# EasyEDA Pro project 毕设.eprj, board PCB1
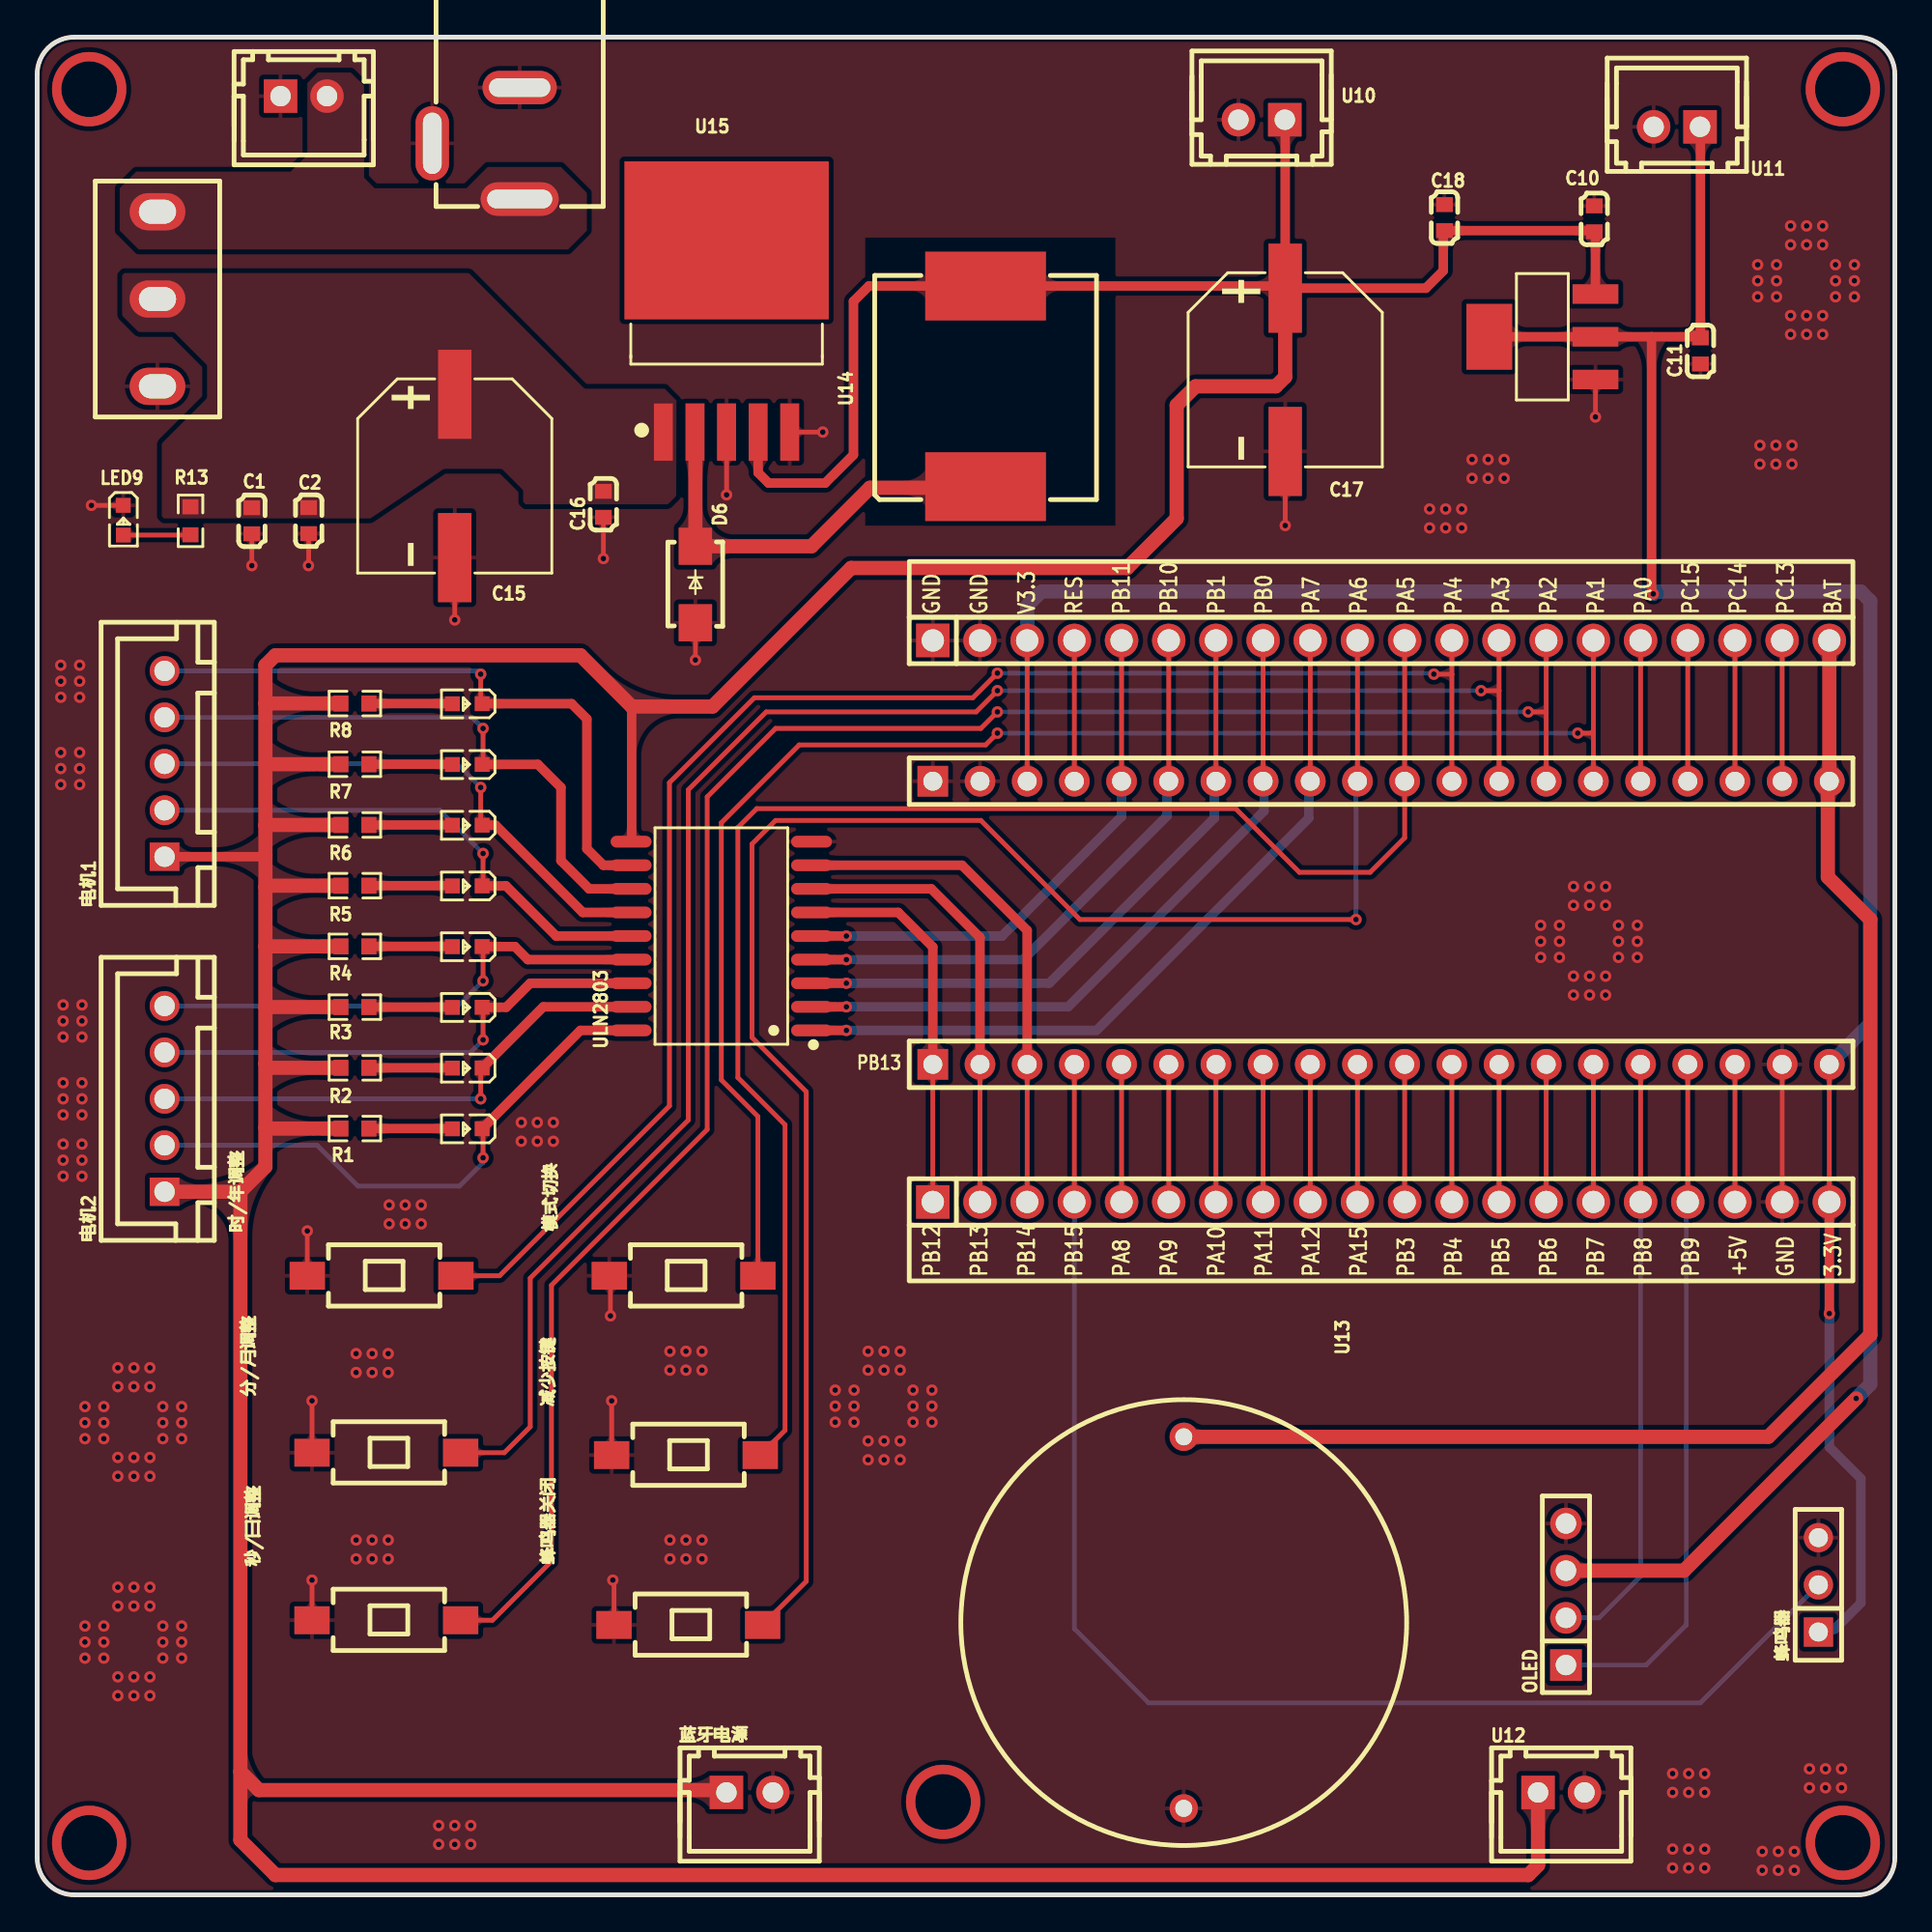
[diagram p3: board, top side]
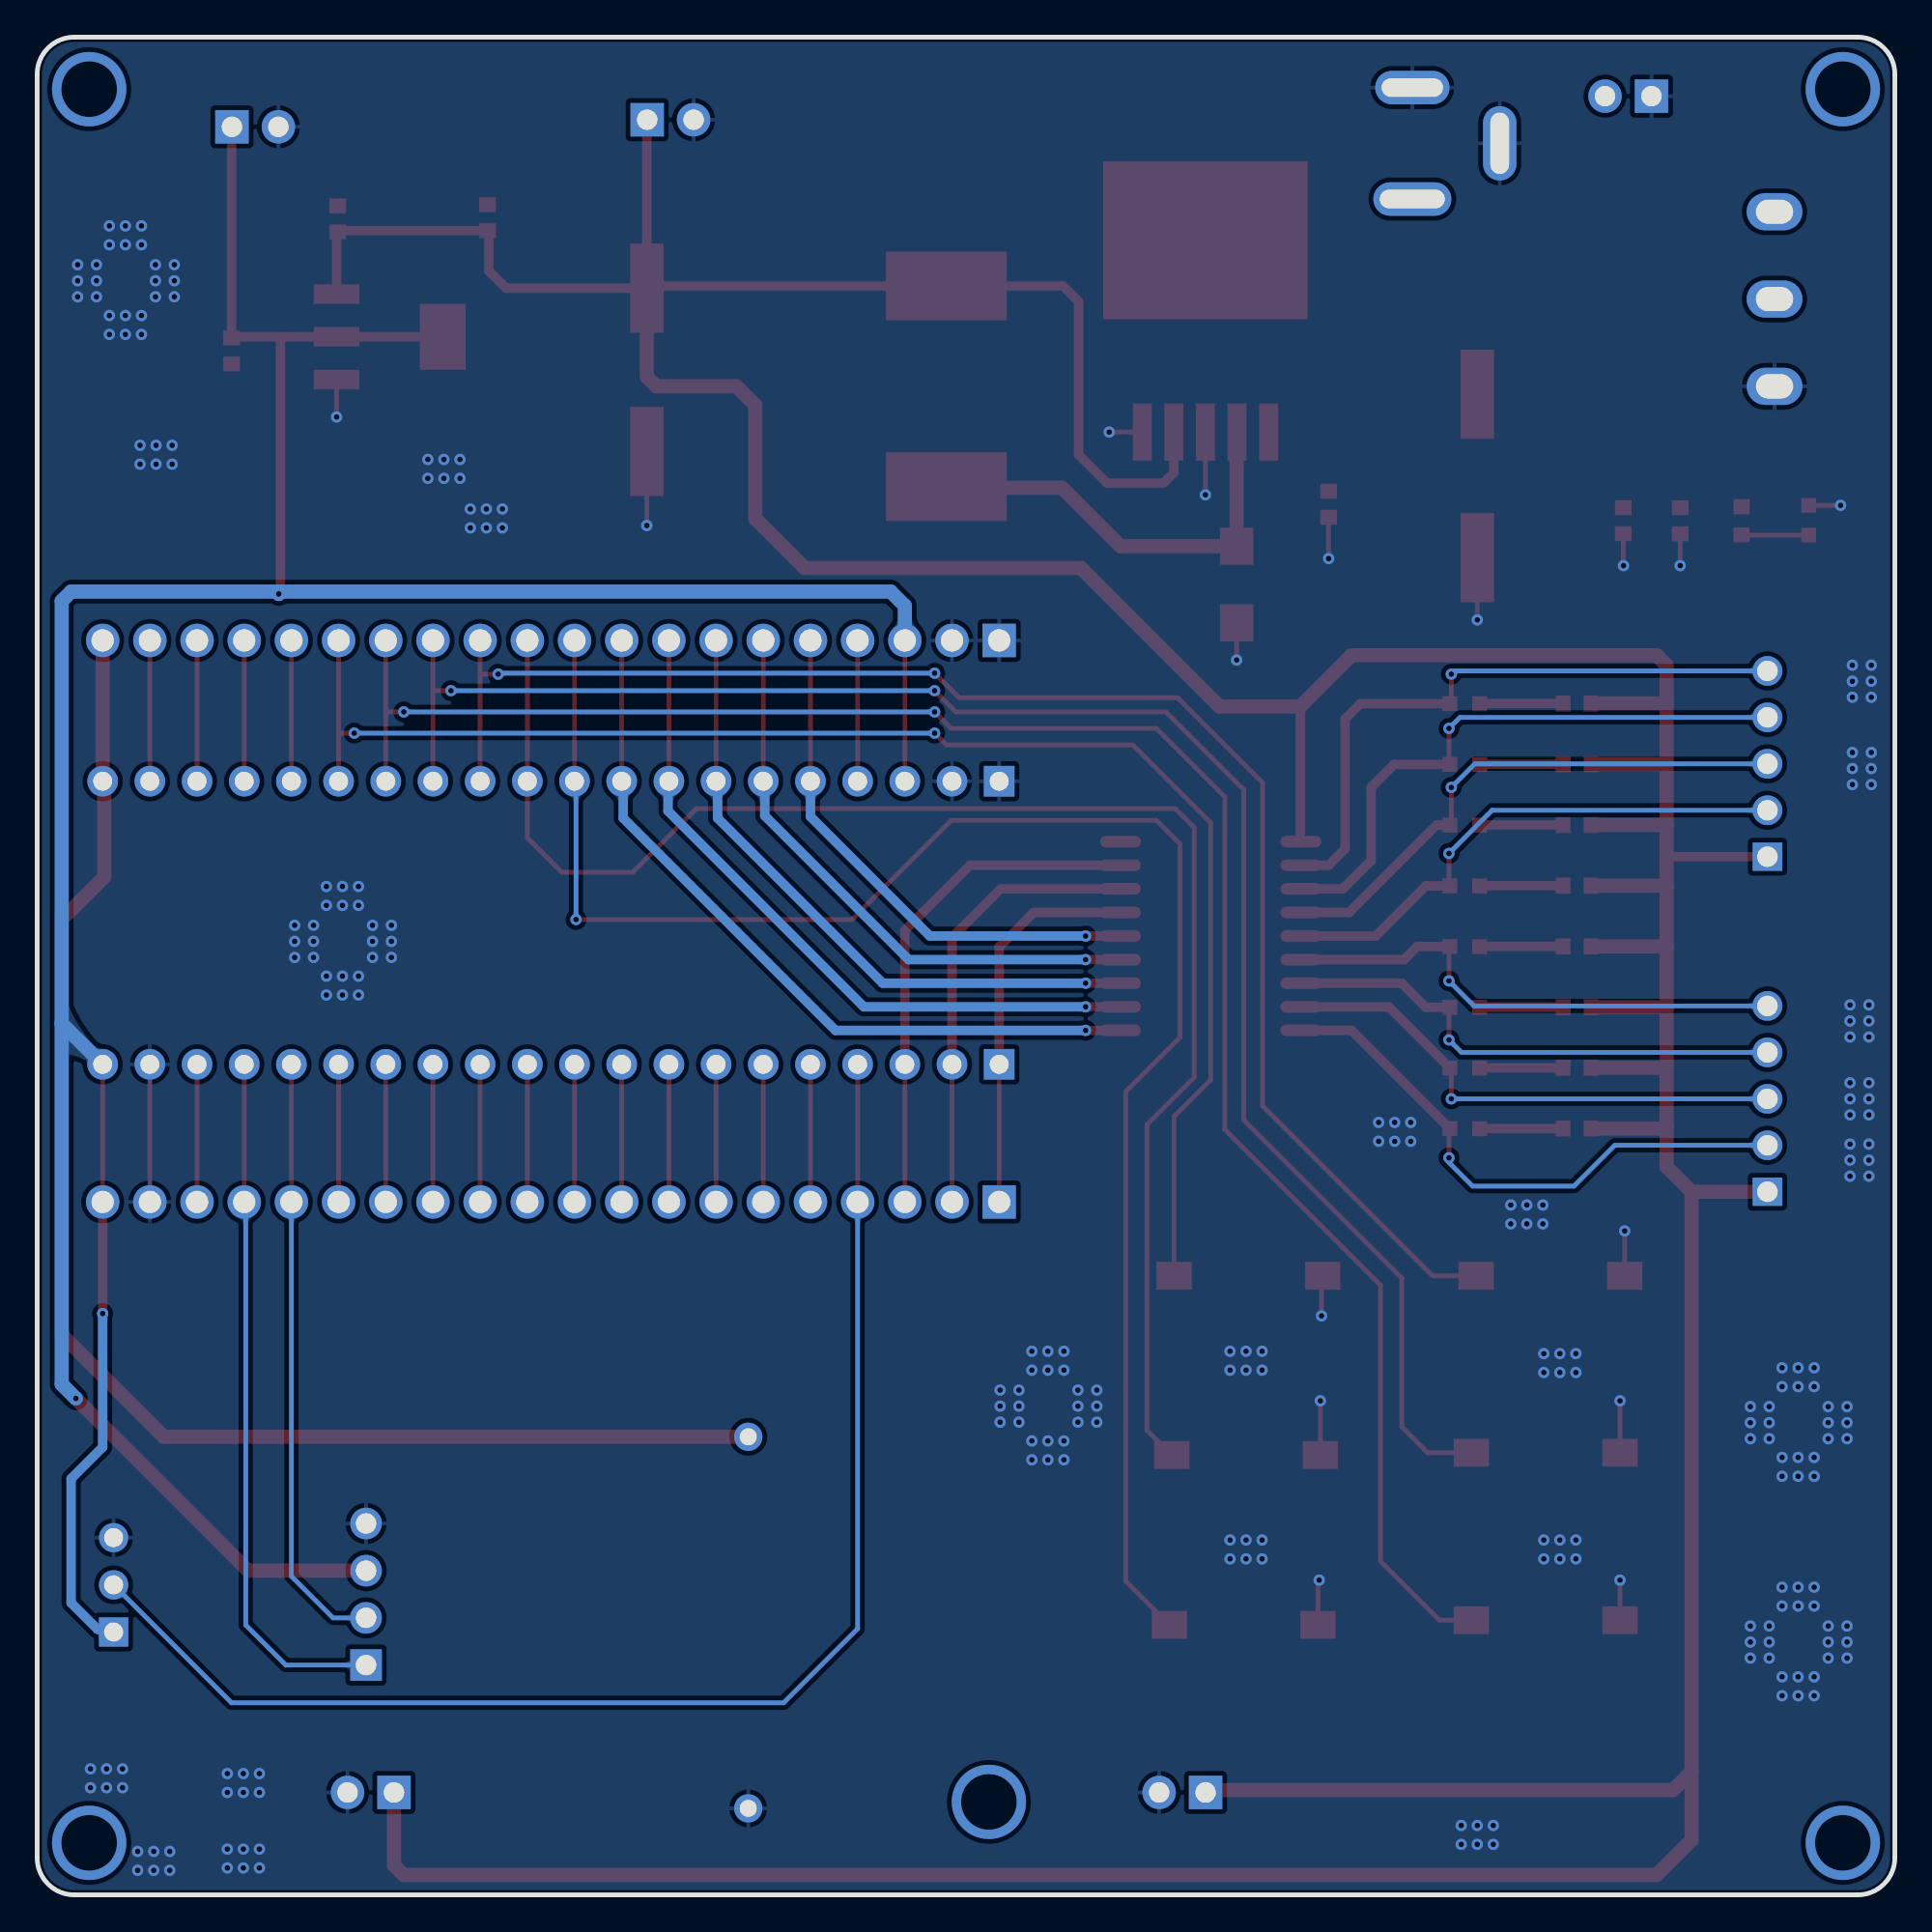
[diagram p4: board, bottom side, seen from below]

Outline 100 x 100 mm; copper layers: Top Layer, Bottom Layer. Coordinates in mm from the lower left corner of the outline.
Outline path: 0,98 0,2 arc(0.59,0.59) 2,0 98,0 arc(99.41,0.59) 100,2 100,98 arc(99.41,99.41) 98,100 2,100 arc(0.59,99.41) 0,98
Stack: Top Layer 0.035mm / Dielectric1 1.51mm FR4 er 4.5 / Bottom Layer 0.035mm

## Design rules (mm)
template: JLCPCB Capability(Two Layers Board)
spacing copperThickness1oz (default): track to track 0.102, other pairs 0.152 to 0.3
spacing copperThickness2oz: track to track 0.203, other pairs 0.152 to 0.3
track width copperThickness1oz (default): min 0.127, default 0.254, max 2.54
track width copperThickness2oz: min 0.203, default 0.254, max 2.54
differential pair differentialPair (default): width min 0.127, default 0.254, max 2.54; gap min 0.152, default 0.152
via viaSize (default): diameter min 0.5, default 0.61, max 10; hole min 0.3, default 0.305, max 6.3

## Placement (name value [footprint] x y rotation side)
C1  100nF  [C0603]  11.56 73.97 270 top
C2  100nF  [C0603]  14.62 73.97 270 top
C10  10μF  [C0603]  83.82 90.22 90 top
C11  10μF  [C0603]  89.53 83.11 90 top
C15  330uF  [CAP-SMD_BD10.0-L10.3-W10.3-LS11.0-R-RD]  22.48 76.38 90 top
C16  0.1μF  [C0603]  30.48 74.85 90 top
C17  330uF  [CAP-SMD_BD10.0-L10.3-W10.3-LS11.0-R-RD]  67.18 82.09 90 top
C18  0.1μF  [C0603]  75.76 90.29 270 top
CN1  ZX-XH2.54-2PZZ  [CONN-TH_2P-P2.50_HX25003-2A]  14.35 96.83 0 top
D6  SS56A  [SMA_L4.2-W2.6-LS5.0-RD]  35.43 70.54 270 top
DC1  DC-005-5A-2.0  [DC-IN-TH_DC-005-5A-2.0]  23.62 94.28 270 top
H2  -  [HDR-TH_20P-P2.54-V-M-1]  72.34 37.3 0 top
H3  -  [HDR-TH_20P-P2.54-V-M-1]  72.34 67.53 0 top
LED1  -  [LED_0603]  23.1 41.23 180 top
LED2  -  [LED_0603]  23.1 44.5 180 top
LED3  -  [LED_0603]  23.1 47.77 180 top
LED4  -  [LED_0603]  23.1 51.04 180 top
LED5  -  [LED_0603]  23.1 54.3 180 top
LED6  -  [LED_0603]  23.1 57.57 180 top
LED7  -  [LED_0603]  23.1 60.84 180 top
LED8  -  [LED_0603]  23.1 64.11 180 top
LED9  -  [LED_0603]  4.64 73.95 270 top
OLED  -  [HDR-TH_4P-P2.54-V-F]  82.3 16.18 90 top
R1  10K  [R0603]  17.1 41.25 180 top
R2  10K  [R0603]  17.1 44.52 180 top
R3  10K  [R0603]  17.1 47.79 180 top
R4  10K  [R0603]  17.1 51.06 180 top
R5  10K  [R0603]  17.1 54.32 180 top
R6  10K  [R0603]  17.1 57.59 180 top
R7  10K  [R0603]  17.1 60.86 180 top
R8  10K  [R0603]  17.1 64.13 180 top
R13  10K  [R0603]  8.25 73.97 90 top
SW1  SS-12D10L5  [SW-TH_SS-12D10L5]  6.48 85.9 90 top
U7  PM254-1-20-Z-8.5  [HDR-TH_20P-P2.54-V-F-2]  72.34 44.71 0 top
U8  PM254-1-20-Z-8.5  [HDR-TH_20P-P2.54-V-F-2]  72.34 59.95 0 top
U9  LM1117IMPX-3.3/NOPB  [SOT-223_L6.5-W3.5-P2.30-LS7.0-BR]  81.03 83.87 0 top
U10  ZX-XH2.54-2PZZ  [CONN-TH_2P-P2.50_HX25003-2A]  65.91 95.56 180 top
U11  ZX-XH2.54-2PZZ  [CONN-TH_2P-P2.50_HX25003-2A]  88.26 95.17 180 top
U12  ZX-XH2.54-2PZZ  [CONN-TH_2P-P2.50_HX25003-2A]  82.04 5.51 0 top
U13  -  [纽扣]  61.72 14.66 270 top
U14  150uH  [IND-SMD_L12.0-W12.0_CDRH125L125NP-470MC]  51.05 81.2 270 top
U15  LM2596S-5.0(UMW)  [TO-263-5_L10.2-W8.9-P1.70-BR]  37.11 83.9 270 top
ULN2803  ULN2803  [SOP-18_L11.6-W7.5-P1.27-LS10.3-BL]  36.83 51.61 90 top
减少按键  TS-1101-C-W  [SW-SMD_L6.0-W3.3-LS8.0]  34.93 23.67 180 top
分/月调整  TS-1101-C-W  [SW-SMD_L6.0-W3.3-LS8.0]  18.8 23.8 180 top
时/年调整  TS-1101-C-W  [SW-SMD_L6.0-W3.3-LS8.0]  18.54 33.33 180 top
模式切换  TS-1101-C-W  [SW-SMD_L6.0-W3.3-LS8.0]  34.8 33.33 180 top
电机1  电机1  [CONN-TH_5P-P2.50_ZX-XH2.54-5PZZ]  6.86 60.88 90 top
电机2  电机2  [CONN-TH_5P-P2.50_ZX-XH2.54-5PZZ]  6.86 42.85 90 top
秒/日调整  TS-1101-C-W  [SW-SMD_L6.0-W3.3-LS8.0]  18.8 14.78 180 top
蓝牙电源  ZX-XH2.54-2PZZ  [CONN-TH_2P-P2.50_HX25003-2A]  38.35 5.51 0 top
蜂鸣器  -  [HDR-TH_3P-P2.54-V-F]  95.88 16.69 90 top
蜂鸣器关闭  TS-1101-C-W  [SW-SMD_L6.0-W3.3-LS8.0]  35.05 14.53 180 top

## Footprints (pads in the part's own frame, mm; a bottom-side part is the same pattern mirrored in y, then rotated)
C0603
  rect 0.8x0.9 smd: 1(-0.7,0) 2(0.7,0)
CAP-SMD_BD10.0-L10.3-W10.3-LS11.0-R-RD
  rect 4.8x1.8 smd: 1(4.395,0) 2(-4.395,0)
CONN-TH_2P-P2.50_HX25003-2A
  rect 1.8x1.8 hole 1.1: 1(-1.25,0)
  round 1.8 hole 1.1: 2(1.25,0)
CONN-TH_5P-P2.50_ZX-XH2.54-5PZZ
  rect 1.524x1.6 hole 1.1: 1(-5,0)
  round 1.6 hole 1.1: 2(-2.5,0) 3(0,0) 4(2.5,0) 5(5,0)
DC-IN-TH_DC-005-5A-2.0
  oval 1.8x4.2 hole 1x3.5: 1(3,2.352)
  oval 1.8x4 hole 1x3.3: 2(-3,2.352)
  oval 4x1.8 hole 3.3x1: 3(-0.001,-2.352)
HDR-TH_3P-P2.54-V-F
  rect 1.575x1.575 hole 1.02: 1(-2.54,0)
  round 1.575 hole 1.02: 2(0,0) 3(2.54,0)
HDR-TH_4P-P2.54-V-F
  rect 1.7x1.7 hole 1.1: 1(-3.81,0)
  round 1.7 hole 1.1: 2(-1.27,0) 3(1.27,0) 4(3.81,0)
HDR-TH_20P-P2.54-V-F-2
  rect 1.65x1.65 hole 1.02: 1(-24.13,0)
  round 1.65 hole 1.02: 2(-21.59,0) 3(-19.05,0) 4(-16.51,0) 5(-13.97,0) 6(-11.43,0) 7(-8.89,0) 8(-6.35,0) 9(-3.81,0) 10(-1.27,0) 11(1.27,0) 12(3.81,0) 13(6.35,0) 14(8.89,0) 15(11.43,0) 16(13.97,0) 17(16.51,0) 18(19.05,0) 19(21.59,0) 20(24.13,0)
HDR-TH_20P-P2.54-V-M-1
  rect 1.8x1.8 hole 1.2: 1(-24.13,0)
  round 1.8 hole 1.2: 2(-21.59,0) 3(-19.05,0) 4(-16.51,0) 5(-13.97,0) 6(-11.43,0) 7(-8.89,0) 8(-6.35,0) 9(-3.81,0) 10(-1.27,0) 11(1.27,0) 12(3.81,0) 13(6.35,0) 14(8.89,0) 15(11.43,0) 16(13.97,0) 17(16.51,0) 18(19.05,0) 19(21.59,0) 20(24.13,0)
IND-SMD_L12.0-W12.0_CDRH125L125NP-470MC
  rect 3.7x6.5 smd: 1(5.4,0) 2(-5.4,0)
LED_0603
  rect 0.8x0.8 smd: 1(-0.851,-0.01) 2(0.75,-0.005)
R0603
  rect 0.806x0.864 smd: 1(-0.753,0) 2(0.753,0)
SMA_L4.2-W2.6-LS5.0-RD
  rect 2x1.8 smd: 1(-2.06,0) 2(2.06,0)
SOP-18_L11.6-W7.5-P1.27-LS10.3-BL
  oval 0.63x2.2 smd: 1(-5.08,-4.857) 2(-3.81,-4.857) 3(-2.54,-4.857) 4(-1.27,-4.857) 5(0,-4.857) 6(1.27,-4.857) 7(2.54,-4.857) 8(3.81,-4.857) 9(5.08,-4.857) 10(5.08,4.857) 11(3.81,4.857) 12(2.54,4.857) 13(1.27,4.857) 14(0,4.857) 15(-1.27,4.857) 16(-2.54,4.857) 17(-3.81,4.857) 18(-5.08,4.857)
SOT-223_L6.5-W3.5-P2.30-LS7.0-BR
  rect 2.465x1.05 smd: 1(2.857,-2.3) 2(2.857,0) 3(2.857,2.3)
  rect 2.465x3.54 smd: 4(-2.857,0)
SW-SMD_L6.0-W3.3-LS8.0
  rect 1.9x1.5 smd: 1(-4,0) 2(4,0)
SW-TH_SS-12D10L5
  oval 2x3 hole 1.3x2: 1(-4.7,0) 2(0,0) 3(4.7,0)
TO-263-5_L10.2-W8.9-P1.70-BR
  rect 3.083x1.02 smd: 1(5.16,-3.4) 2(5.16,-1.7) 3(5.16,0) 4(5.16,1.7) 5(5.16,3.4)
  rect 8.5x11 smd: 6(-5.16,0)
纽扣
  round 1.524 hole 0.914x0.85: VBAT(-10,0) VBATLOW(10,0)

## Nets
As in the schematic.

Pads without a net: U15 6

## Via types
v1: diameter 4, hole 2.999, Top Layer to Bottom Layer, 5 vias
v2: diameter 0.61, hole 0.305, Top Layer to Bottom Layer, 275 vias

## Routing (per net, layer and track width the routed paths; a pad name or vN(x,y) marks a point on that pad's centre or on a via; arc(x,y) is an arc through that point)
5V: length 7.4
  Top Layer w0.254: H2.18 U7.18
GND: length 46.2
  Top Layer w0.254: D6.2 v2(35.43,66.47) ; C17.2 v2(67.18,73.71) ; U7.19 H2.19 ; C1.2 v2(11.56,71.55) ; U15.3 v2(37.11,75.36) ; 秒/日调整.2 v2(14.8,16.94) ; C2.2 14.62,71.56 v2(14.61,71.55) ; v2(30.99,16.94) 31.05,16.88 蜂鸣器关闭.2 ; 时/年调整.2 v2(14.54,35.74) ; C16.1 v2(30.48,71.93) ; C15.2 v2(22.48,68.63) ; U15.5 v2(42.29,78.74) ; 4.64,74.8 v2(2.92,74.8) ; v2(30.86,31.17) 30.86,33.26 模式切换.2 ; 减少按键.2 v2(30.93,26.59) ; U9.1 v2(83.88,79.55) ; 分/月调整.2 v2(14.8,26.59)
  vias: v2(1.27,66.19) v2(1.27,65.33) v2(1.27,64.47) v2(1.27,61.49) v2(1.27,60.63) v2(1.27,59.77) v2(1.4,47.9) v2(1.4,47.04) v2(1.4,46.18) v2(1.4,43.71) v2(1.4,42.85) v2(1.4,41.99) v2(1.4,40.41) v2(1.4,39.55) v2(1.4,38.68) v2(2.29,66.19) v2(2.29,65.33) v2(2.29,64.47) v2(2.29,61.49) v2(2.29,60.63) v2(2.29,59.77) v2(2.41,47.9) v2(2.41,47.04) v2(2.41,46.18) v2(2.41,43.71) v2(2.41,42.85) v2(2.41,41.99) v2(2.41,40.41) v2(2.41,39.55) v2(2.41,38.68) v2(2.57,26.28) v2(2.57,25.42) v2(2.57,24.56) v2(2.57,14.47) v2(2.57,13.61) v2(2.57,12.74) v2(3.59,26.28) v2(3.59,25.42) v2(3.59,24.56) v2(3.59,14.47) v2(3.59,13.61) v2(3.59,12.74) v2(4.34,28.37) v2(4.34,27.36) v2(4.34,23.55) v2(4.34,22.53) v2(4.34,16.56) v2(4.34,15.54) v2(4.34,11.74) v2(4.34,10.72) v2(5.21,28.37) v2(5.21,27.36) v2(5.21,23.55) v2(5.21,22.53) v2(5.21,16.56) v2(5.21,15.54) v2(5.21,11.74) v2(5.21,10.72) v2(6.07,28.37) v2(6.07,27.36) v2(6.07,23.55) v2(6.07,22.53) v2(6.07,16.56) v2(6.07,15.54) v2(6.07,11.74) v2(6.07,10.72) v2(6.76,26.28) v2(6.76,25.42) v2(6.76,24.56) v2(6.76,14.47) v2(6.76,13.61) v2(6.76,12.74) v2(7.78,26.28) v2(7.78,25.42) v2(7.78,24.56) v2(7.78,14.47) v2(7.78,13.61) v2(7.78,12.74) v2(17.17,29.13) v2(17.17,28.12) v2(17.17,19.1) v2(17.17,18.09) v2(18.03,29.13) v2(18.03,28.12) v2(18.03,19.1) v2(18.03,18.09) v2(18.95,37.14) v2(18.95,36.12) v2(18.9,29.13) v2(18.9,28.12) v2(18.9,19.1) v2(18.9,18.09) v2(19.81,37.14) v2(19.81,36.12) v2(20.68,37.14) v2(20.68,36.12) v2(21.62,3.73) v2(21.62,2.72) v2(22.48,3.73) v2(22.48,2.72) v2(23.34,3.73) v2(23.34,2.72) v2(26.06,41.58) v2(26.06,40.56) v2(26.92,41.58) v2(26.92,40.56) v2(27.79,41.58) v2(27.79,40.56) v2(34.06,29.26) v2(34.06,28.25) v2(34.06,19.1) v2(34.06,18.09) v2(34.93,29.26) v2(34.93,28.25) v2(34.93,19.1) v2(34.93,18.09) v2(35.79,29.26) v2(35.79,28.25) v2(35.79,19.1) v2(35.79,18.09) v2(42.96,27.17) v2(42.96,26.31) v2(42.96,25.44) v2(43.97,27.17) v2(43.97,26.31) v2(43.97,25.44) v2(44.73,29.26) v2(44.73,28.25) v2(44.73,24.44) v2(44.73,23.42) v2(45.59,29.26) v2(45.59,28.25) v2(45.59,24.44) v2(45.59,23.42) v2(46.46,29.26) v2(46.46,28.25) v2(46.46,24.44) v2(46.46,23.42) v2(47.15,27.17) v2(47.15,26.31) v2(47.15,25.44) v2(48.17,27.17) v2(48.17,26.31) v2(48.17,25.44) v2(74.96,74.6) v2(74.96,73.58) v2(75.82,74.6) v2(75.82,73.58) v2(76.68,74.6) v2(76.68,73.58) v2(77.24,77.27) v2(77.24,76.25) v2(78.1,77.27) v2(78.1,76.25) v2(78.97,77.27) v2(78.97,76.25) v2(80.93,52.19) v2(80.93,51.33) v2(80.93,50.46) v2(81.95,52.19) v2(81.95,51.33) v2(81.95,50.46) v2(82.7,54.28) v2(82.7,53.26) v2(82.7,49.45) v2(82.7,48.44) v2(83.57,54.28) v2(83.57,53.26) v2(83.57,49.45) v2(83.57,48.44) v2(84.43,54.28) v2(84.43,53.26) v2(84.43,49.45) v2(84.43,48.44) v2(85.12,52.19) v2(85.12,51.33) v2(85.12,50.46) v2(86.14,52.19) v2(86.14,51.33) v2(86.14,50.46) v2(88.04,6.53) v2(88.04,5.51) v2(88.04,2.46) v2(88.04,1.45) v2(88.9,6.53) v2(88.9,5.51) v2(88.9,2.46) v2(88.9,1.45) v2(89.76,6.53) v2(89.76,5.51) v2(89.76,2.46) v2(89.76,1.45) v2(92.62,87.75) v2(92.62,86.89) v2(92.62,86.02) v2(92.74,78.03) v2(92.74,77.01) v2(92.86,2.34) v2(92.86,1.32) v2(93.63,87.75) v2(93.63,86.89) v2(93.63,86.02) v2(93.6,78.03) v2(93.6,77.01) v2(93.73,2.34) v2(93.73,1.32) v2(94.39,89.84) v2(94.39,88.82) v2(94.39,85.01) v2(94.39,84) v2(94.46,78.03) v2(94.46,77.01) v2(94.59,2.34) v2(94.59,1.32) v2(95.25,89.84) v2(95.25,88.82) v2(95.25,85.01) v2(95.25,84) v2(95.4,6.78) v2(95.4,5.77) v2(96.11,89.84) v2(96.11,88.82) v2(96.11,85.01) v2(96.11,84) v2(96.27,6.78) v2(96.27,5.77) v2(96.81,87.75) v2(96.81,86.89) v2(96.81,86.02) v2(97.13,6.78) v2(97.13,5.77) v2(97.82,87.75) v2(97.82,86.89) v2(97.82,86.02)
VBAT: length 77.6
  Top Layer w0.762: H3.20 U8.20 96.39,59.87 96.39,54.79 98.68,52.5 98.68,30.15 93.19,24.66 U13.VBAT
VCC+3.3V: length 190.6
  Top Layer w0.254: H3.3 U8.3 ; H2.20 U7.20
  Top Layer w0.508: 86.9,83.87 89.47,83.87 C11.2 89.53,95.15 U11.1 ; 86.9,83.87 U9.2 U9.4 ; 86.9,83.87 86.9,70.12 v2(87,70.03) ; H2.20 v2(96.47,31.29)
  Top Layer w0.762: v2(97.92,26.72) 88.65,17.45 OLED.3
  Bottom Layer w0.508: 蜂鸣器.1 96.03,14.3 96.75,14.3 98.17,15.72 98.17,22.4 96.47,24.1 v2(96.47,31.29)
  Bottom Layer w0.762: H3.3 53.29,69.39 54.06,70.16 86.87,70.16 v2(87,70.03) 87.12,70.16 98.17,70.16 98.68,69.65 98.68,46.91 ; 98.68,46.91 98.68,27.48 v2(97.92,26.72) ; 98.68,46.91 U7.20
VCC+5V: length 358.4
  Top Layer w0.508: ULN2803.10 32,56.72 32,63.97 ; C17.1 74.75,86.49 75.69,87.43 75.69,89.52 C18.2 83.75,89.59 C10.1 83.88,89.45 83.88,86.17 ; C17.1 67.18,95.53 U10.1 ; C17.1 67.07,86.6 U14.2 44.77,86.6 43.94,85.78 43.94,77.52 42.42,76 39.37,76 38.81,76.56 U15.4 ; 12.29,55.97 12.21,55.88 电机1.1
  Top Layer w0.762: U12.1 80.79,1.59 80.26,1.07 12.83,1.07 10.94,2.95 10.94,6.64 ; 12.29,41.29 12.33,41.25 16.35,41.25 ; 12.29,41.29 12.29,39.2 10.94,37.85 ; 12.29,41.29 12.29,44.73 ; 10.94,37.85 电机2.1 ; 10.94,37.85 10.94,6.64 ; 10.94,6.64 11.94,5.64 36.98,5.64 蓝牙电源.1 ; 16.35,64.13 16.35,64.13 12.29,64.13 ; 16.35,44.52 12.5,44.52 12.29,44.73 ; 12.29,64.13 12.29,60.91 ; 12.29,64.13 12.29,66.19 12.83,66.73 29.25,66.73 32,63.97 36.36,63.97 43.81,71.42 58.67,71.42 61.34,74.09 61.34,80.19 62.36,81.2 66.68,81.2 67.18,81.71 C17.1 ; 12.29,60.91 12.34,60.86 16.35,60.86 ; 12.29,60.91 12.29,57.58 ; 12.29,44.73 12.29,47.77 ; 16.35,47.79 12.31,47.79 12.29,47.77 ; 12.29,51.05 12.29,47.77 ; 12.29,51.05 12.29,54.25 ; 12.29,51.05 12.3,51.06 16.35,51.06 ; 16.35,57.59 12.3,57.59 12.29,57.58 ; 12.29,57.58 12.29,54.25 ; 12.29,54.25 12.36,54.32 16.35,54.32
(no net):
  vias: v1(2.8,97.2) v1(2.8,2.8) v1(48.77,5) v1(97.2,97.2) v1(97.2,2.8)
1C: length 30.6
  Top Layer w0.254: LED1.1 24,41.19 v2(24,39.67)
  Top Layer w0.508: ULN2803.18 29.25,46.53 LED1.1
  Bottom Layer w0.254: v2(24,39.67) 24,39.42 22.73,38.15 17.27,38.15 15.07,40.35 电机2.2
2C: length 28
  Top Layer w0.254: v2(23.88,42.85) 23.88,44.43
  Top Layer w0.508: ULN2803.17 27.25,47.8 LED2.1
  Bottom Layer w0.254: 电机2.3 v2(23.88,42.85)
3C: length 27.8
  Top Layer w0.254: v2(24,46.03) 24,47.73 LED3.1
  Top Layer w0.508: LED3.1 25.25,47.78 26.54,49.07 ULN2803.16
  Bottom Layer w0.254: 电机2.4 23.33,45.35 v2(24,46.03)
4C: length 27.9
  Top Layer w0.254: LED4.1 24,51 v2(24,49.2)
  Top Layer w0.508: LED4.1 25.71,51.05 26.42,50.34 ULN2803.15
  Bottom Layer w0.254: 电机2.5 22.65,47.85 v2(24,49.2)
5C: length 29
  Top Layer w0.254: v2(24,56.06) 24,54.36 LED5.1
  Top Layer w0.508: LED5.1 25.24,54.31 27.94,51.61 ULN2803.14
  Bottom Layer w0.254: v2(24,56.06) 21.68,58.38 电机1.2
6C: length 29.6
  Top Layer w0.254: 23.95,57.58 23.88,57.66 v2(23.88,59.61)
  Top Layer w0.508: 23.95,57.58 24.67,57.58 29.37,52.88 ULN2803.13
  Bottom Layer w0.254: v2(23.88,59.61) 22.61,60.88 电机1.3
7C: length 32.4
  Top Layer w0.254: LED7.1 24,60.9 v2(24,62.79)
  Top Layer w0.508: ULN2803.12 29.72,54.15 28.19,55.68 28.19,59.61 26.96,60.85 LED7.1
  Bottom Layer w0.254: v2(24,62.79) 23.41,63.38 电机1.4
8C: length 34.4
  Top Layer w0.254: v2(23.88,65.71) 23.88,64.2 LED8.1
  Top Layer w0.508: LED8.1 28.77,64.12 29.59,63.3 29.59,56.31 30.48,55.42 ULN2803.11
  Bottom Layer w0.254: v2(23.88,65.71) 23.7,65.88 电机1.5
PA0: length 7.6
  Top Layer w0.254: U8.16 H3.16
PA1: length 81.8
  Top Layer w0.254: 83.77,62.66 83.65,62.53 v2(82.93,62.53) ; 83.77,62.66 U8.15 ; 83.77,62.66 H3.15 ; v2(51.69,62.53) 51.05,61.9 41.02,61.9 36.83,57.71 36.83,43.87 38.8,41.9 模式切换.1
  Bottom Layer w0.254: v2(51.69,62.53) v2(82.93,62.53)
PA2: length 105.5
  Top Layer w0.254: 81.23,63.66 H3.14 ; 81.23,63.66 U8.14 ; 81.23,63.66 81.22,63.68 v2(80.26,63.68) ; v2(51.69,63.68) 50.8,62.79 39.75,62.79 36.07,59.11 36.07,41.2 27.69,32.82 27.69,17.96 24.51,14.78 秒/日调整.1
  Bottom Layer w0.254: 81.28,59.9 U8.14 ; v2(51.69,63.68) v2(80.26,63.68)
PA3: length 95.6
  Top Layer w0.254: v2(51.69,64.82) 50.55,63.68 39.24,63.68 35.05,59.49 35.05,41.71 26.54,33.2 26.54,25.2 25.15,23.8 分/月调整.1 ; 78.69,64.83 78.69,64.82 v2(77.72,64.82) ; 78.69,64.83 H3.13 ; 78.69,64.83 U8.13
  Bottom Layer w0.254: v2(51.69,64.82) v2(77.72,64.82)
PA4: length 84.8
  Top Layer w0.254: U8.12 76.15,65.7 ; 76.15,65.7 H3.12 ; 76.15,65.7 76.14,65.71 v2(75.18,65.71) ; v2(51.69,65.76) 50.37,64.44 38.61,64.44 34.04,59.87 34.04,42.47 24.89,33.33 时/年调整.1
  Bottom Layer w0.254: v2(75.18,65.71) 75.13,65.76 v2(51.69,65.76)
PA5: length 84.5
  Top Layer w0.254: H3.11 U8.11 73.61,56.9 71.75,55.04 67.94,55.04 64.52,58.47 38.74,58.47 37.72,57.45 37.72,43.99 40.26,41.45 40.26,25.01 减少按键.1
PA6: length 94.5
  Top Layer w0.254: U8.10 H3.10 ; v2(70.99,52.5) 56.13,52.5 50.8,57.84 39.75,57.84 38.48,56.57 38.48,46.15 41.4,43.23 41.4,16.88 蜂鸣器关闭.1
  Bottom Layer w0.254: U8.10 70.99,59.87 v2(70.99,52.5)
PA7: length 41.1
  Top Layer w0.254: H3.9 U8.9
  Top Layer w0.508: ULN2803.1 v2(43.56,46.53)
  Bottom Layer w0.508: U8.9 68.45,59.87 68.45,57.96 57.02,46.53 v2(43.56,46.53)
PA8: length 7.5
  Top Layer w0.254: U7.5 H2.5
  Bottom Layer w0.254: 58.42,37.25 H2.5
PA9: length 7.4
  Top Layer w0.254: H2.6 U7.6
PA10: length 7.4
  Top Layer w0.254: U7.7 H2.7
PA11: length 7.4
  Top Layer w0.254: H2.8 U7.8
PA12: length 7.4
  Top Layer w0.254: U7.9 H2.9
PA15: length 7.4
  Top Layer w0.254: H2.10 U7.10
PB0: length 37.9
  Top Layer w0.254: U8.8 H3.8
  Top Layer w0.508: ULN2803.2 v2(43.56,47.8)
  Bottom Layer w0.508: v2(43.56,47.8) 55.5,47.8 66.04,58.34 66.04,59.9 U8.8
PB1: length 35
  Top Layer w0.254: H3.7 U8.7
  Top Layer w0.508: ULN2803.3 v2(43.56,49.07)
  Bottom Layer w0.508: U8.7 63.37,59.87 63.37,57.96 54.48,49.07 v2(43.56,49.07)
PB3: length 7.4
  Top Layer w0.254: U7.11 H2.11
PB4: length 7.4
  Top Layer w0.254: H2.12 U7.12
PB5: length 7.4
  Top Layer w0.254: U7.13 H2.13
PB6: length 7.4
  Top Layer w0.254: H2.14 U7.14
PB7: length 7.4
  Top Layer w0.254: U7.15 H2.15
PB8: length 32.5
  Top Layer w0.254: H2.16 U7.16
  Bottom Layer w0.254: H2.16 86.31,17.15 84.07,14.91 OLED.2
PB9: length 37.6
  Top Layer w0.254: U7.17 H2.17
  Bottom Layer w0.254: H2.17 88.77,37.22 88.77,14.53 86.61,12.37 OLED.1
PB10: length 31.8
  Top Layer w0.254: U8.6 H3.6
  Top Layer w0.508: ULN2803.4 v2(43.56,50.34)
  Bottom Layer w0.508: U8.6 60.83,59.87 60.83,58.09 53.09,50.34 v2(43.56,50.34)
PB11: length 28.8
  Top Layer w0.254: H3.5 U8.5
  Top Layer w0.508: ULN2803.5 v2(43.56,51.61)
  Bottom Layer w0.508: v2(43.56,51.61) 51.94,51.61 58.37,58.04 U8.5
PB12: length 21
  Top Layer w0.254: U7.1 H2.1
  Top Layer w0.508: U7.1 48.21,51.02 46.35,52.88 ULN2803.6
PB13: length 24.4
  Top Layer w0.254: H2.2 U7.2
  Top Layer w0.508: ULN2803.7 48.13,54.15 50.75,51.53 U7.2
PB14: length 27.7
  Top Layer w0.254: U7.3 H2.3
  Top Layer w0.508: ULN2803.8 49.78,55.42 53.29,51.91 U7.3
PB15: length 74.7
  Top Layer w0.254: H2.4 U7.4
  Bottom Layer w0.254: 蜂鸣器.2 89.53,10.34 59.82,10.34 55.83,14.32 H2.4
PC13: length 7.6
  Top Layer w0.254: H3.19 U8.19
PC14: length 7.6
  Top Layer w0.254: U8.18 H3.18
PC15: length 7.6
  Top Layer w0.254: H3.17 U8.17
RES: length 7.6
  Top Layer w0.254: U8.4 H3.4
$1N3478: length 4.5
  Top Layer w0.508: 22.35,41.24 22.34,41.25 R1.1
$1N3503: length 4.5
  Top Layer w0.508: 22.35,44.5 22.34,44.52 R2.1
$1N3528: length 4.5
  Top Layer w0.508: 22.35,47.77 22.34,47.79 R3.1
$1N3553: length 4.5
  Top Layer w0.508: R4.1 22.34,51.06 22.35,51.04
$1N3578: length 4.5
  Top Layer w0.508: 22.35,54.31 22.34,54.32 R5.1
$1N3603: length 4.5
  Top Layer w0.508: R6.1 22.34,57.59 22.35,57.58
$1N3628: length 4.5
  Top Layer w0.508: 22.35,60.85 22.34,60.86 R7.1
$1N3653: length 4.5
  Top Layer w0.508: 22.35,64.11 22.34,64.13 R8.1
$1N15283: length 3.6
  Top Layer w0.254: LED9.2 8.24,73.2 R13.1
$1N27648: length 23.1
  Top Layer w0.762: U15.2 35.43,78.72 D6.1 41.68,72.6 44.83,75.74 50.99,75.74 U14.1

## Copper pours and planes (outline as drawn; the poured copper is in the pictures)
GND on Top Layer: -10.67,109.27 111.51,109.27 111.51,-12.9 -10.67,-12.9
GND on Bottom Layer: -9.14,106.73 108.46,106.73 108.46,-8.71 -9.14,-8.71
VCC12V on Top Layer: 4.57,87.3 34.41,87.3 34.41,74.09 4.57,74.09
VIN on Top Layer: 4.44,98.09 29.59,98.09 29.59,88.57 4.44,88.57

Small or netless copper shapes (teardrops, artwork), in the pictures only: 246 on Top Layer, 49 on Bottom Layer

## Text on the board
Top Silkscreen Layer: PB13 | GND | PB12 | V3.3 | PB14 | RES | PB15 | PB11 | PA8 | PB10 | PA9 | PB1 | PA10 | PB0 | PA11 | PA7 | PA12 | PA6 | PA15 | PA5 | PB3 | PA4 | PB4 | PA3 | PB5 | PA2 | PB6 | PA1 | PB7 | PA0 | PB8 | PC15 | PB9 | PC14 | +5V | PC13 | BAT | 3.3V
